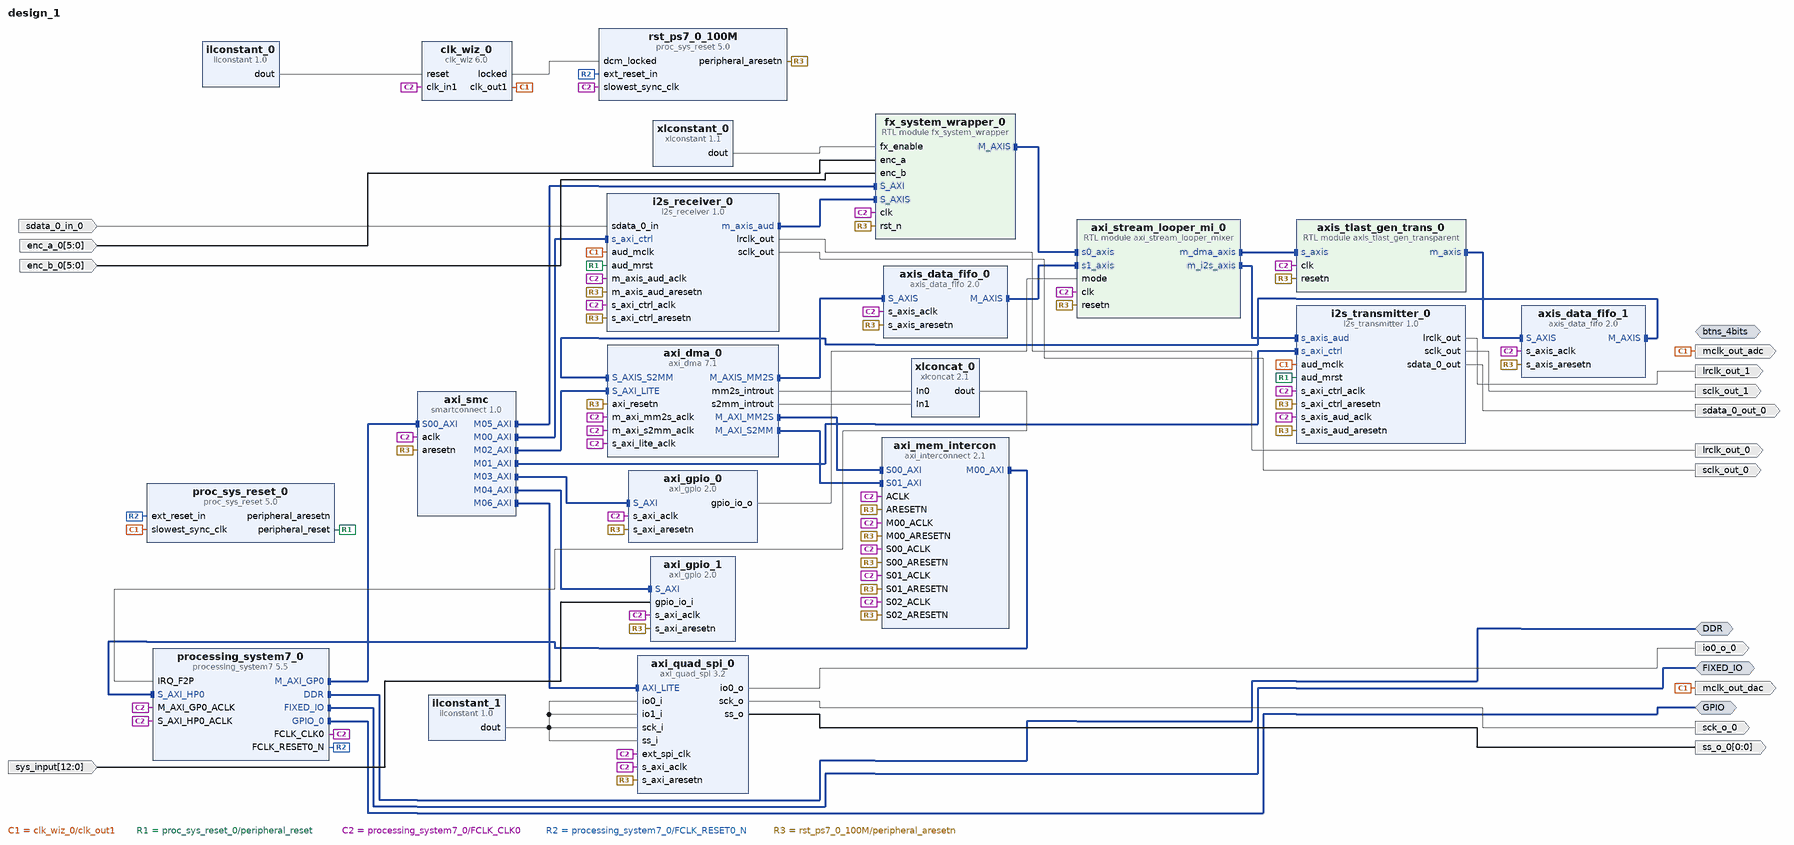
[diagram p0: block diagram of the top level]
# Vivado block design design_1, xc7z020clg400-1, Vivado 2025.1
create_bd_design design_1

create_bd_intf_port -mode Master -vlnv xilinx.com:interface:ddrx_rtl:1.0 DDR
create_bd_intf_port -mode Master -vlnv xilinx.com:display_processing_system7:fixedio_rtl:1.0 FIXED_IO
create_bd_intf_port -mode Master -vlnv xilinx.com:interface:gpio_rtl:1.0 btns_4bits
create_bd_intf_port -mode Master -vlnv xilinx.com:interface:gpio_rtl:1.0 GPIO
create_bd_port -dir O sclk_out_0
create_bd_port -dir O lrclk_out_0
create_bd_port -dir O sdata_0_out_0
create_bd_port -dir O sclk_out_1
create_bd_port -dir O lrclk_out_1
create_bd_port -dir O -type clk mclk_out_dac
create_bd_port -dir O -type clk mclk_out_adc
create_bd_port -dir I sdata_0_in_0
create_bd_port -dir I -from 5 -to 0 enc_a_0
create_bd_port -dir I -from 5 -to 0 enc_b_0
create_bd_port -dir O io0_o_0
create_bd_port -dir O sck_o_0
create_bd_port -dir O -from 0 -to 0 ss_o_0
create_bd_port -dir I -from 12 -to 0 sys_input

create_bd_cell -type ip -vlnv xilinx.com:ip:processing_system7:5.5 processing_system7_0
set_property -dict [list \
  CONFIG.PCW_APU_PERIPHERAL_FREQMHZ 650 \
  CONFIG.PCW_CRYSTAL_PERIPHERAL_FREQMHZ 50 \
  CONFIG.PCW_ENET0_ENET0_IO {MIO 16 .. 27} \
  CONFIG.PCW_ENET0_GRP_MDIO_ENABLE 1 \
  CONFIG.PCW_ENET0_GRP_MDIO_IO {MIO 52 .. 53} \
  CONFIG.PCW_ENET0_PERIPHERAL_ENABLE 1 \
  CONFIG.PCW_ENET0_RESET_ENABLE 1 \
  CONFIG.PCW_ENET0_RESET_IO {MIO 9} \
  CONFIG.PCW_ENET_RESET_ENABLE 1 \
  CONFIG.PCW_ENET_RESET_SELECT {Share reset pin} \
  CONFIG.PCW_EN_CLK1_PORT 1 \
  CONFIG.PCW_FCLK_CLK1_BUF TRUE \
  CONFIG.PCW_FPGA0_PERIPHERAL_FREQMHZ 50 \
  CONFIG.PCW_FPGA1_PERIPHERAL_FREQMHZ 12.288 \
  CONFIG.PCW_FPGA_FCLK1_ENABLE 1 \
  CONFIG.PCW_GPIO_EMIO_GPIO_ENABLE 1 \
  CONFIG.PCW_GPIO_EMIO_GPIO_IO 2 \
  CONFIG.PCW_GPIO_EMIO_GPIO_WIDTH 2 \
  CONFIG.PCW_GPIO_MIO_GPIO_ENABLE 1 \
  CONFIG.PCW_GPIO_MIO_GPIO_IO MIO \
  CONFIG.PCW_I2C_RESET_ENABLE 1 \
  CONFIG.PCW_IRQ_F2P_INTR 1 \
  CONFIG.PCW_M_AXI_GP0_FREQMHZ 10 \
  CONFIG.PCW_PERIPHERAL_BOARD_PRESET part0 \
  CONFIG.PCW_PRESET_BANK1_VOLTAGE {LVCMOS 1.8V} \
  CONFIG.PCW_QSPI_GRP_FBCLK_ENABLE 1 \
  CONFIG.PCW_QSPI_GRP_FBCLK_IO {MIO 8} \
  CONFIG.PCW_QSPI_GRP_SINGLE_SS_ENABLE 1 \
  CONFIG.PCW_QSPI_GRP_SINGLE_SS_IO {MIO 1 .. 6} \
  CONFIG.PCW_QSPI_PERIPHERAL_ENABLE 1 \
  CONFIG.PCW_QSPI_QSPI_IO {MIO 1 .. 6} \
  CONFIG.PCW_SD0_GRP_CD_ENABLE 1 \
  CONFIG.PCW_SD0_GRP_CD_IO {MIO 47} \
  CONFIG.PCW_SD0_GRP_WP_ENABLE 0 \
  CONFIG.PCW_SD0_PERIPHERAL_ENABLE 1 \
  CONFIG.PCW_SD0_SD0_IO {MIO 40 .. 45} \
  CONFIG.PCW_SDIO_PERIPHERAL_FREQMHZ 50 \
  CONFIG.PCW_SINGLE_QSPI_DATA_MODE x4 \
  CONFIG.PCW_S_AXI_HP0_DATA_WIDTH 32 \
  CONFIG.PCW_UART0_PERIPHERAL_ENABLE 1 \
  CONFIG.PCW_UART0_UART0_IO {MIO 14 .. 15} \
  CONFIG.PCW_UART1_PERIPHERAL_ENABLE 0 \
  CONFIG.PCW_UART_PERIPHERAL_FREQMHZ 100 \
  CONFIG.PCW_UIPARAM_DDR_BUS_WIDTH {16 Bit} \
  CONFIG.PCW_UIPARAM_DDR_FREQ_MHZ 525 \
  CONFIG.PCW_UIPARAM_DDR_PARTNO {MT41J256M16 RE-125} \
  CONFIG.PCW_USB0_PERIPHERAL_ENABLE 1 \
  CONFIG.PCW_USB0_RESET_ENABLE 1 \
  CONFIG.PCW_USB0_RESET_IO {MIO 46} \
  CONFIG.PCW_USB0_USB0_IO {MIO 28 .. 39} \
  CONFIG.PCW_USB_RESET_ENABLE 1 \
  CONFIG.PCW_USB_RESET_SELECT {Share reset pin} \
  CONFIG.PCW_USE_FABRIC_INTERRUPT 1 \
  CONFIG.PCW_USE_S_AXI_HP0 1 \
  CONFIG.preset None \
] [get_bd_cells processing_system7_0]
# 494 more settings of processing_system7_0 are not shown: defaults, MIO pin electricals, DDR timing, and values the tool derives
create_bd_cell -type ip -vlnv xilinx.com:ip:i2s_receiver:1.0 i2s_receiver_0
set_property -dict {CONFIG.C_32BIT_LR 1} [get_bd_cells i2s_receiver_0]
create_bd_cell -type ip -vlnv xilinx.com:ip:i2s_transmitter:1.0 i2s_transmitter_0
set_property -dict {CONFIG.C_32BIT_LR 1} [get_bd_cells i2s_transmitter_0]
create_bd_cell -type ip -vlnv xilinx.com:ip:smartconnect:1.0 axi_smc
set_property -dict {CONFIG.NUM_CLKS 1 CONFIG.NUM_MI 7 CONFIG.NUM_SI 1} [get_bd_cells axi_smc]
create_bd_cell -type ip -vlnv xilinx.com:ip:proc_sys_reset:5.0 rst_ps7_0_100M
create_bd_cell -type ip -vlnv xilinx.com:ip:proc_sys_reset:5.0 proc_sys_reset_0
create_bd_cell -type inline_hdl -vlnv xilinx.com:inline_hdl:ilconstant:1.0 ilconstant_0
set_property -dict {CONFIG.CONST_VAL 0} [get_bd_cells ilconstant_0]
create_bd_cell -type module -reference axi_stream_looper_mixer axi_stream_looper_mi_0
create_bd_cell -type ip -vlnv xilinx.com:ip:axi_dma:7.1 axi_dma_0
set_property -dict {CONFIG.c_include_sg 0 CONFIG.c_mm2s_burst_size 256 CONFIG.c_s2mm_burst_size 256} [get_bd_cells axi_dma_0]
create_bd_cell -type ip -vlnv xilinx.com:ip:axis_data_fifo:2.0 axis_data_fifo_0
set_property -dict [list \
  CONFIG.FIFO_DEPTH 2048 \
  CONFIG.HAS_TLAST 1 \
  CONFIG.IS_ACLK_ASYNC 0 \
  CONFIG.TDATA_NUM_BYTES 4 \
] [get_bd_cells axis_data_fifo_0]
create_bd_cell -type ip -vlnv xilinx.com:ip:axis_data_fifo:2.0 axis_data_fifo_1
set_property -dict [list \
  CONFIG.FIFO_DEPTH 2048 \
  CONFIG.FIFO_MODE 2 \
  CONFIG.IS_ACLK_ASYNC 0 \
  CONFIG.TDATA_NUM_BYTES 4 \
] [get_bd_cells axis_data_fifo_1]
create_bd_cell -type module -reference axis_tlast_gen_transparent axis_tlast_gen_trans_0
set_property -dict {CONFIG.PKT_SIZE 512} [get_bd_cells axis_tlast_gen_trans_0]
create_bd_cell -type ip -vlnv xilinx.com:ip:axi_interconnect:2.1 axi_mem_intercon
set_property -dict {CONFIG.NUM_MI 1 CONFIG.NUM_SI 3} [get_bd_cells axi_mem_intercon]
create_bd_cell -type ip -vlnv xilinx.com:ip:axi_gpio:2.0 axi_gpio_0
set_property -dict {CONFIG.C_ALL_OUTPUTS 1 CONFIG.C_GPIO_WIDTH 2} [get_bd_cells axi_gpio_0]
create_bd_cell -type ip -vlnv xilinx.com:ip:clk_wiz:6.0 clk_wiz_0
set_property -dict [list \
  CONFIG.CLKIN1_JITTER_PS 200.0 \
  CONFIG.CLKOUT1_JITTER 373.299 \
  CONFIG.CLKOUT1_PHASE_ERROR 409.976 \
  CONFIG.CLKOUT1_REQUESTED_OUT_FREQ 12.288 \
  CONFIG.MMCM_CLKFBOUT_MULT_F 61.000 \
  CONFIG.MMCM_CLKIN1_PERIOD 20.000 \
  CONFIG.MMCM_CLKIN2_PERIOD 10.0 \
  CONFIG.MMCM_CLKOUT0_DIVIDE_F 82.750 \
  CONFIG.MMCM_DIVCLK_DIVIDE 3 \
  CONFIG.PRIM_IN_FREQ 50.000 \
] [get_bd_cells clk_wiz_0]
create_bd_cell -type ip -vlnv xilinx.com:ip:axi_gpio:2.0 axi_gpio_1
set_property -dict {CONFIG.C_ALL_INPUTS 1 CONFIG.C_GPIO_WIDTH 13} [get_bd_cells axi_gpio_1]
create_bd_cell -type module -reference fx_system_wrapper fx_system_wrapper_0
create_bd_cell -type ip -vlnv xilinx.com:ip:axi_quad_spi:3.2 axi_quad_spi_0
set_property -dict [list \
  CONFIG.C_FIFO_DEPTH 256 \
  CONFIG.C_SCK_RATIO 2 \
  CONFIG.QSPI_BOARD_INTERFACE Custom \
  CONFIG.USE_BOARD_FLOW true \
] [get_bd_cells axi_quad_spi_0]
create_bd_cell -type inline_hdl -vlnv xilinx.com:inline_hdl:ilconstant:1.0 ilconstant_1
create_bd_cell -type ip -vlnv xilinx.com:ip:xlconstant:1.1 xlconstant_0
create_bd_cell -type ip -vlnv xilinx.com:ip:xlconcat:2.1 xlconcat_0

# ---- connections ----

connect_bd_intf_net [get_bd_intf_pins axi_dma_0/M_AXIS_MM2S] [get_bd_intf_pins axis_data_fifo_0/S_AXIS]
connect_bd_intf_net [get_bd_intf_pins axi_dma_0/M_AXI_MM2S] [get_bd_intf_pins axi_mem_intercon/S00_AXI]
connect_bd_intf_net [get_bd_intf_pins axi_dma_0/M_AXI_S2MM] [get_bd_intf_pins axi_mem_intercon/S01_AXI]
connect_bd_intf_net [get_bd_intf_pins axi_mem_intercon/M00_AXI] [get_bd_intf_pins processing_system7_0/S_AXI_HP0]
connect_bd_intf_net [get_bd_intf_pins axi_smc/M00_AXI] [get_bd_intf_pins i2s_receiver_0/s_axi_ctrl]
connect_bd_intf_net [get_bd_intf_pins axi_smc/M01_AXI] [get_bd_intf_pins i2s_transmitter_0/s_axi_ctrl]
connect_bd_intf_net [get_bd_intf_pins axi_smc/M02_AXI] [get_bd_intf_pins axi_dma_0/S_AXI_LITE]
connect_bd_intf_net [get_bd_intf_pins axi_gpio_0/S_AXI] [get_bd_intf_pins axi_smc/M03_AXI]
connect_bd_intf_net [get_bd_intf_pins axi_smc/M04_AXI] [get_bd_intf_pins axi_gpio_1/S_AXI]
connect_bd_intf_net [get_bd_intf_pins axi_smc/M05_AXI] [get_bd_intf_pins fx_system_wrapper_0/S_AXI]
connect_bd_intf_net [get_bd_intf_pins axi_smc/M06_AXI] [get_bd_intf_pins axi_quad_spi_0/AXI_LITE]
connect_bd_intf_net [get_bd_intf_pins axi_stream_looper_mi_0/m_dma_axis] [get_bd_intf_pins axis_tlast_gen_trans_0/s_axis]
connect_bd_intf_net [get_bd_intf_pins axi_stream_looper_mi_0/m_i2s_axis] [get_bd_intf_pins i2s_transmitter_0/s_axis_aud]
connect_bd_intf_net [get_bd_intf_pins axis_data_fifo_0/M_AXIS] [get_bd_intf_pins axi_stream_looper_mi_0/s1_axis]
connect_bd_intf_net [get_bd_intf_pins axis_data_fifo_1/M_AXIS] [get_bd_intf_pins axi_dma_0/S_AXIS_S2MM]
connect_bd_intf_net [get_bd_intf_pins axis_tlast_gen_trans_0/m_axis] [get_bd_intf_pins axis_data_fifo_1/S_AXIS]
connect_bd_intf_net [get_bd_intf_pins fx_system_wrapper_0/M_AXIS] [get_bd_intf_pins axi_stream_looper_mi_0/s0_axis]
connect_bd_intf_net [get_bd_intf_pins i2s_receiver_0/m_axis_aud] [get_bd_intf_pins fx_system_wrapper_0/S_AXIS]
connect_bd_intf_net [get_bd_intf_ports DDR] [get_bd_intf_pins processing_system7_0/DDR]
connect_bd_intf_net [get_bd_intf_ports FIXED_IO] [get_bd_intf_pins processing_system7_0/FIXED_IO]
connect_bd_intf_net [get_bd_intf_ports GPIO] [get_bd_intf_pins processing_system7_0/GPIO_0]
connect_bd_intf_net [get_bd_intf_pins processing_system7_0/M_AXI_GP0] [get_bd_intf_pins axi_smc/S00_AXI]
connect_bd_net [get_bd_pins axi_dma_0/mm2s_introut] [get_bd_pins xlconcat_0/In0]
connect_bd_net [get_bd_pins axi_dma_0/s2mm_introut] [get_bd_pins xlconcat_0/In1]
connect_bd_net [get_bd_pins axi_gpio_0/gpio_io_o] [get_bd_pins axi_stream_looper_mi_0/mode]
connect_bd_net [get_bd_pins axi_quad_spi_0/io0_o] [get_bd_ports io0_o_0]
connect_bd_net [get_bd_pins axi_quad_spi_0/sck_o] [get_bd_ports sck_o_0]
connect_bd_net [get_bd_pins axi_quad_spi_0/ss_o] [get_bd_ports ss_o_0]
connect_bd_net -net clk_wiz_0_clk_aud [get_bd_pins clk_wiz_0/clk_out1] \
  [get_bd_ports mclk_out_dac] [get_bd_ports mclk_out_adc] [get_bd_pins i2s_receiver_0/aud_mclk] \
  [get_bd_pins i2s_transmitter_0/aud_mclk] [get_bd_pins proc_sys_reset_0/slowest_sync_clk]
connect_bd_net [get_bd_pins clk_wiz_0/locked] [get_bd_pins rst_ps7_0_100M/dcm_locked]
connect_bd_net -net enc_a_0_1 [get_bd_ports enc_a_0] [get_bd_pins fx_system_wrapper_0/enc_a]
connect_bd_net -net enc_b_0_1 [get_bd_ports enc_b_0] [get_bd_pins fx_system_wrapper_0/enc_b]
connect_bd_net -net gpio_io_i_0_1 [get_bd_ports sys_input] [get_bd_pins axi_gpio_1/gpio_io_i]
connect_bd_net [get_bd_pins i2s_receiver_0/lrclk_out] [get_bd_ports lrclk_out_0]
connect_bd_net [get_bd_pins i2s_receiver_0/sclk_out] [get_bd_ports sclk_out_0]
connect_bd_net [get_bd_pins i2s_transmitter_0/lrclk_out] [get_bd_ports lrclk_out_1]
connect_bd_net [get_bd_pins i2s_transmitter_0/sclk_out] [get_bd_ports sclk_out_1]
connect_bd_net [get_bd_pins i2s_transmitter_0/sdata_0_out] [get_bd_ports sdata_0_out_0]
connect_bd_net [get_bd_pins ilconstant_0/dout] [get_bd_pins clk_wiz_0/reset]
connect_bd_net [get_bd_pins ilconstant_1/dout] \
  [get_bd_pins axi_quad_spi_0/io0_i] [get_bd_pins axi_quad_spi_0/io1_i] [get_bd_pins axi_quad_spi_0/sck_i] \
  [get_bd_pins axi_quad_spi_0/ss_i]
# net proc_sys_reset_0_peripheral_aresetn has one end: proc_sys_reset_0/peripheral_aresetn
connect_bd_net [get_bd_pins proc_sys_reset_0/peripheral_reset] [get_bd_pins i2s_receiver_0/aud_mrst] [get_bd_pins i2s_transmitter_0/aud_mrst]
connect_bd_net [get_bd_pins processing_system7_0/FCLK_CLK0] \
  [get_bd_pins axi_dma_0/s_axi_lite_aclk] [get_bd_pins axi_dma_0/m_axi_s2mm_aclk] [get_bd_pins axi_dma_0/m_axi_mm2s_aclk] \
  [get_bd_pins axis_data_fifo_0/s_axis_aclk] [get_bd_pins axi_mem_intercon/ACLK] [get_bd_pins axi_mem_intercon/S00_ACLK] \
  [get_bd_pins axi_mem_intercon/M00_ACLK] [get_bd_pins axi_mem_intercon/S01_ACLK] [get_bd_pins axi_mem_intercon/S02_ACLK] \
  [get_bd_pins axi_smc/aclk] [get_bd_pins i2s_receiver_0/s_axi_ctrl_aclk] [get_bd_pins i2s_transmitter_0/s_axi_ctrl_aclk] \
  [get_bd_pins processing_system7_0/M_AXI_GP0_ACLK] [get_bd_pins processing_system7_0/S_AXI_HP0_ACLK] \
  [get_bd_pins rst_ps7_0_100M/slowest_sync_clk] [get_bd_pins clk_wiz_0/clk_in1] [get_bd_pins axi_gpio_1/s_axi_aclk] \
  [get_bd_pins i2s_receiver_0/m_axis_aud_aclk] [get_bd_pins i2s_transmitter_0/s_axis_aud_aclk] \
  [get_bd_pins axi_stream_looper_mi_0/clk] [get_bd_pins axis_tlast_gen_trans_0/clk] \
  [get_bd_pins axis_data_fifo_1/s_axis_aclk] [get_bd_pins axi_gpio_0/s_axi_aclk] [get_bd_pins axi_quad_spi_0/ext_spi_clk] \
  [get_bd_pins axi_quad_spi_0/s_axi_aclk] [get_bd_pins fx_system_wrapper_0/clk]
connect_bd_net [get_bd_pins processing_system7_0/FCLK_RESET0_N] [get_bd_pins proc_sys_reset_0/ext_reset_in] [get_bd_pins rst_ps7_0_100M/ext_reset_in]
connect_bd_net [get_bd_pins rst_ps7_0_100M/peripheral_aresetn] \
  [get_bd_pins axi_dma_0/axi_resetn] [get_bd_pins axi_mem_intercon/S00_ARESETN] [get_bd_pins axi_mem_intercon/M00_ARESETN] \
  [get_bd_pins axi_mem_intercon/ARESETN] [get_bd_pins axi_mem_intercon/S01_ARESETN] \
  [get_bd_pins axi_mem_intercon/S02_ARESETN] [get_bd_pins axis_data_fifo_0/s_axis_aresetn] [get_bd_pins axi_smc/aresetn] \
  [get_bd_pins i2s_receiver_0/s_axi_ctrl_aresetn] [get_bd_pins i2s_transmitter_0/s_axi_ctrl_aresetn] \
  [get_bd_pins axi_gpio_1/s_axi_aresetn] [get_bd_pins i2s_receiver_0/m_axis_aud_aresetn] \
  [get_bd_pins i2s_transmitter_0/s_axis_aud_aresetn] [get_bd_pins axi_stream_looper_mi_0/resetn] \
  [get_bd_pins axis_tlast_gen_trans_0/resetn] [get_bd_pins axis_data_fifo_1/s_axis_aresetn] \
  [get_bd_pins axi_gpio_0/s_axi_aresetn] [get_bd_pins axi_quad_spi_0/s_axi_aresetn] [get_bd_pins fx_system_wrapper_0/rst_n]
connect_bd_net -net sdata_0_in_0_1 [get_bd_ports sdata_0_in_0] [get_bd_pins i2s_receiver_0/sdata_0_in]
connect_bd_net [get_bd_pins xlconcat_0/dout] [get_bd_pins processing_system7_0/IRQ_F2P]
connect_bd_net [get_bd_pins xlconstant_0/dout] [get_bd_pins fx_system_wrapper_0/fx_enable]
set_property PFM.CLOCK {  FCLK_CLK0 {id "0" is_default "true" proc_sys_reset "rst_ps7_0_100M" status "fixed"}  } [get_bd_cells processing_system7_0]

# ---- address map ----
assign_bd_address -offset 0x00000000 -range 512M -target_address_space [get_bd_addr_spaces axi_dma_0/Data_MM2S] [get_bd_addr_segs processing_system7_0/S_AXI_HP0/HP0_DDR_LOWOCM]
assign_bd_address -offset 0x00000000 -range 512M -target_address_space [get_bd_addr_spaces axi_dma_0/Data_S2MM] [get_bd_addr_segs processing_system7_0/S_AXI_HP0/HP0_DDR_LOWOCM]
assign_bd_address -offset 0x40400000 -range 64K -target_address_space [get_bd_addr_spaces processing_system7_0/Data] [get_bd_addr_segs axi_dma_0/S_AXI_LITE/Reg]
assign_bd_address -offset 0x41200000 -range 64K -target_address_space [get_bd_addr_spaces processing_system7_0/Data] [get_bd_addr_segs axi_gpio_0/S_AXI/Reg]
assign_bd_address -offset 0x41210000 -range 64K -target_address_space [get_bd_addr_spaces processing_system7_0/Data] [get_bd_addr_segs axi_gpio_1/S_AXI/Reg]
assign_bd_address -offset 0x41E00000 -range 64K -target_address_space [get_bd_addr_spaces processing_system7_0/Data] [get_bd_addr_segs axi_quad_spi_0/AXI_LITE/Reg]
assign_bd_address -offset 0x43C00000 -range 64K -target_address_space [get_bd_addr_spaces processing_system7_0/Data] [get_bd_addr_segs i2s_receiver_0/s_axi_ctrl/Reg]
assign_bd_address -offset 0x43C10000 -range 64K -target_address_space [get_bd_addr_spaces processing_system7_0/Data] [get_bd_addr_segs i2s_transmitter_0/s_axi_ctrl/Reg]
assign_bd_address -offset 0x60000000 -range 512M -target_address_space [get_bd_addr_spaces processing_system7_0/Data] [get_bd_addr_segs fx_system_wrapper_0/S_AXI/reg0]

validate_bd_design
save_bd_design
